# Altium schematic sheet Sheet 4 - Capteurs.SchDoc
size A4
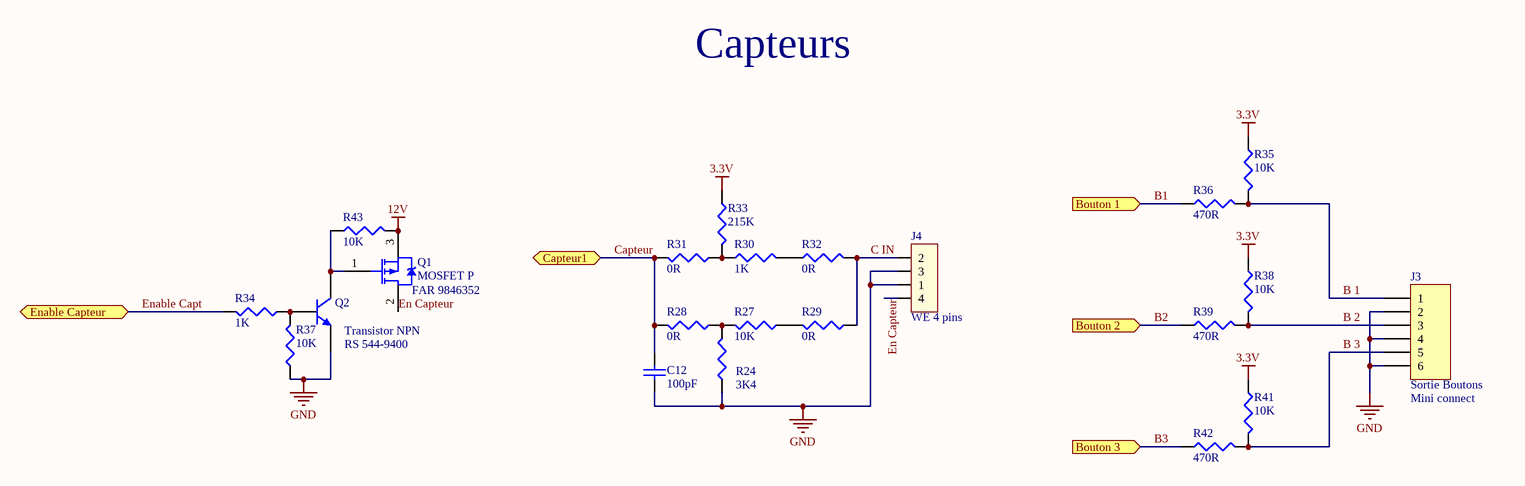
[diagram p0: Sheet 4 - Capteurs.SchDoc]

## Parts
C12  100pF  [C0805]
J3  Mini connect  VALUE1: Sortie Boutons  [690367280676]
J4  WE 4 pins  [690367280476]
Q1  MOSFET P  référence commande: FAR 9846352  [SOT-23]
Q2  Transistor NPN  référence commande: RS 544-9400  [SOT23_L]
R24  3K4  [0805]
R27  10K  [0805]
R28  0R  [0805]
R29  0R  [0805]
R30  1K  [0805]
R31  0R  [0805]
R32  0R  [0805]
R33  215K  [0805]
R34  1K  [0805]
R35  10K  [0805]
R36  470R  [0805]
R37  10K  [0805]
R38  10K  [0805]
R39  470R  [0805]
R41  10K  [0805]
R42  470R  [0805]
R43  10K  [0805]

## Ports
Bouton 1 (in), Bouton 2 (in), Bouton 3 (in), Capteur1 (bidir), Enable Capteur (bidir)

## Nets
3.3V: R33.1 R35.1 R38.1 R41.1
12V: Q1.3(S) R43.2
GND: C12.2 J3.2 J3.4 J3.6 J4.1 J4.3 Q2.2(E) R24.1 R37.1
B1: R36.1 ; port Bouton 1
B2: R39.1 ; port Bouton 2
B3: R42.1 ; port Bouton 3
B 1: J3.1 R35.2 R36.2
B 2: J3.3 R38.2 R39.2
B 3: J3.5 R41.2 R42.2
C IN: J4.2 R29.1 R32.2
Capteur: C12.1 R28.2 R31.2 ; port Capteur1
En Capteur: J4.4 Q1.2(D)
Enable Capt: R34.2 ; port Enable Capteur
NetQ1_1: Q1.1(G) Q2.3(C) R43.1
NetQ2_1: Q2.1(B) R34.1 R37.2
NetR24_2: R24.2 R27.2 R28.1
NetR27_1: R27.1 R29.2
NetR30_1: R30.1 R31.1 R33.2
NetR30_2: R30.2 R32.1

## Notes on the sheet
- Capteurs

## Library data of the parts
C12 = Cap: Capacitor 0805; Published: 8-Jun-2000; LatestRevisionDate: 17-Jul-2002; LatestRevisionNote: Re-released for DXP Platform.; PackageReference: RAD-0.3; Publisher: Altium Limited; Value: 100pF
J3 = MHDR1X6: Header, 6-Pin; value: 690367280676; LatestRevisionDate: 17-Jul-2002; LatestRevisionNote: Re-released for DXP Platform.; Publisher: Altium Limited; Supplier Part Number 1: 129-1787; Supplier 1: Farnell
J4 = MICRO-MATCH FOB.04P: connecteur WE; value: 690367280476; Supplier Part Number 1: 378-4710; Supplier 1: Farnell
Q1 = PMOS-2: P-Channel Power MOSFET; pin to pad: 1>2 2>1; Note: Pin 4 not drawn and electrically connected to Pin 2.; value: NDS0605; Published: 8-Jun-2000; LatestRevisionDate: 17-Jul-2002; LatestRevisionNote: Re-released for DXP Platform.; DatasheetVersion: PD-9.390D; PackageReference: TO-220AB; Publisher: Altium Limited; Code_JEDEC: TO-220-AB; ComponentLink1Description: Manufacturer Link; ComponentLink1URL: http://www.irf.com/; Supplier Part Number 1: 984-6352; Supplier 1: Farnell
Q2 = QNPN: NPN Bipolar Transistor; value: MMBT2222ALT1G; Published: 8-Jun-2000; LatestRevisionDate: 29-May-2009; LatestRevisionNote: IPC-7351 Footprint Added.; PackageVersion: Aug-1999; PackageReference: SOT-23B; Publisher: Altium Limited; PackageDescription: 3-Pin SOT-23 Package 0.95 mm Pitch, 2.4 mm Lead Span; Supplier Part Number 1: 544-9400; Supplier 1: RS
R24 R27-R34 R37 R43 = Res3: Resistor 0805; Published: 8-Jun-2000; LatestRevisionDate: 29-May-2009; LatestRevisionNote: IPC-7351 Footprint Added.; PackageReference: J1-0603; Publisher: Altium Limited; PackageDescription: Chip Resistor
  R24: Value: 3k4
  R27 R37 R43: Value: 10K
  R28 R29 R31 R32: Value: 0R
  R30 R34: Value: 1K
  R33: Value: 215K
R35 R36 R38 R39 R41 R42 = Res3: Resistor 0805; Value: 0R; Published: 8-Jun-2000; LatestRevisionDate: 29-May-2009; LatestRevisionNote: IPC-7351 Footprint Added.; PackageReference: J1-0603; Publisher: Altium Limited; PackageDescription: Chip Resistor